# Altium project Starboard 2U.PrjPcb
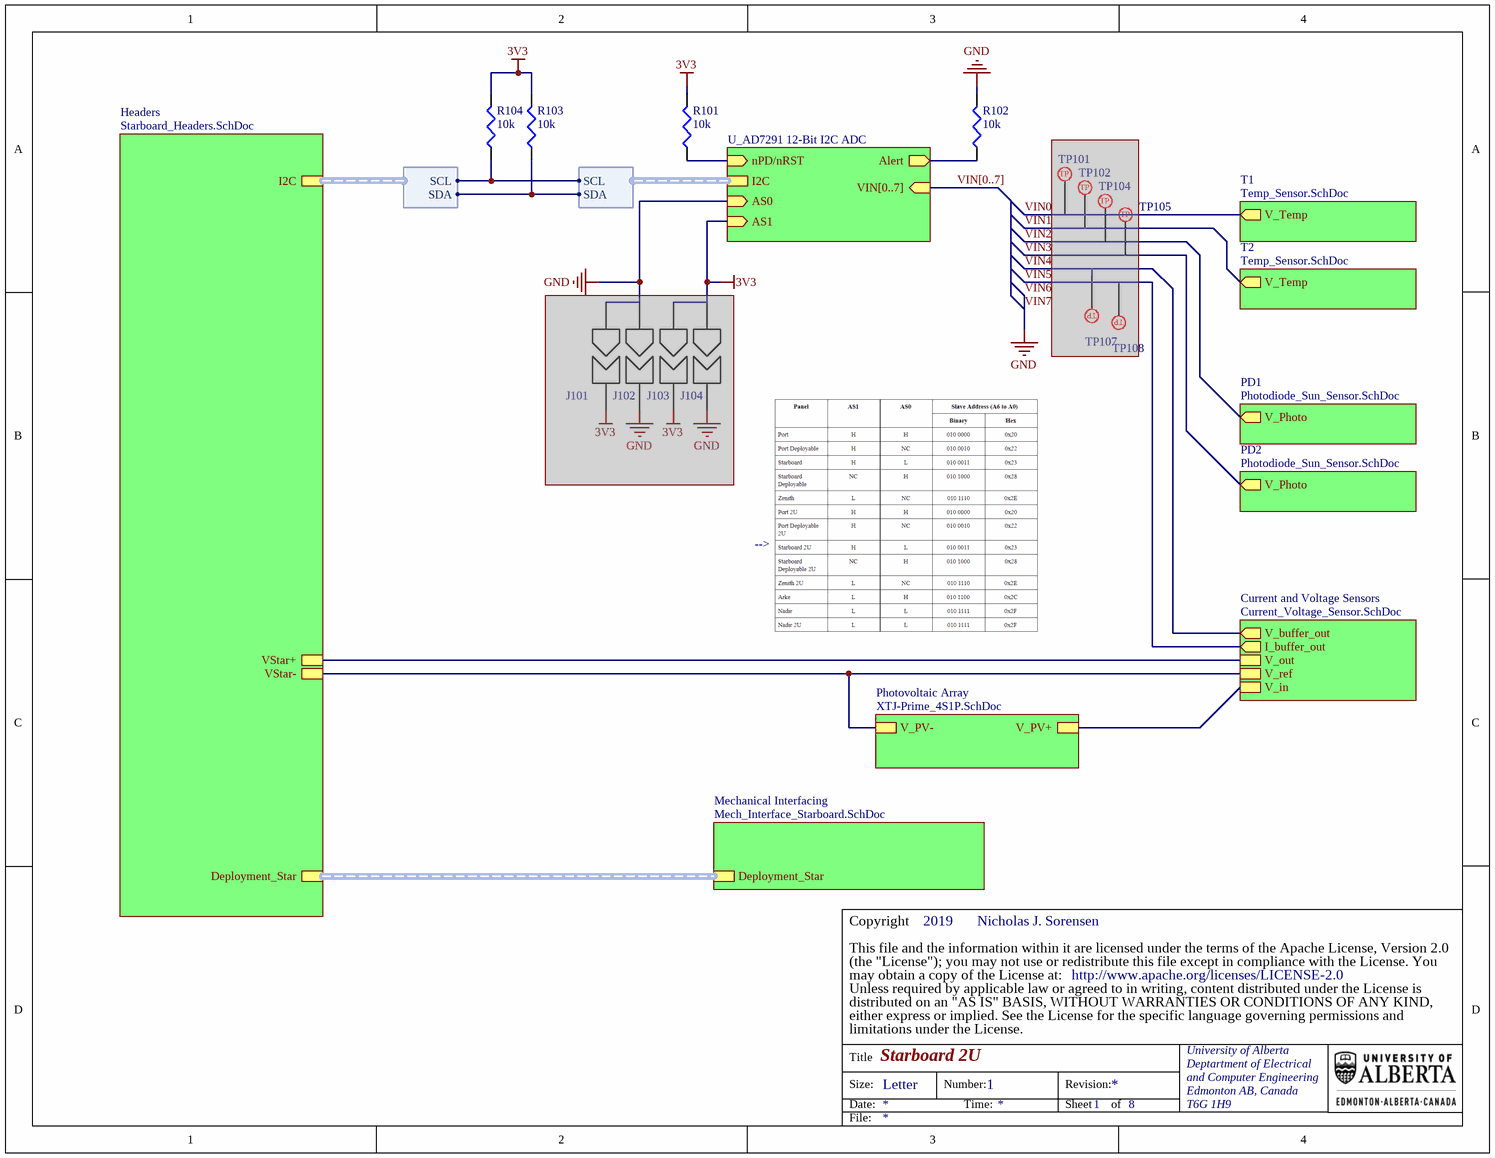
[diagram p0: Starboard 2U.SchDoc]
ProjectVersion: 4.03; SVNVersion: 3196
3 sheets, 33 parts. Net scope: hierarchical (ports join the sheet entries above them; power ports are global).
Board file: Starboard Solar Panel 2U.PcbDoc
Sheets:
  Starboard 2U.SchDoc
    Mechanical Interfacing = Mech_Interface_Starboard.SchDoc
    Headers = Starboard_Headers.SchDoc

## Sheet Starboard 2U.SchDoc: Starboard 2U
size Letter; Author: Nicholas J. Sorensen; DocumentNumber: 1; SheetNumber: 1; SheetTotal: 8; CopyrightYear: 2019

### Parts
J101  Jumping Pad  [Jumping Pad]  (value not drawn)  (masked out: inside a compile mask, not in the netlist)
J102  Jumping Pad  [Jumping Pad]  (value not drawn)  (masked out: inside a compile mask, not in the netlist)
J103  Jumping Pad  [Jumping Pad]  (value not drawn)  (masked out: inside a compile mask, not in the netlist)
J104  Jumping Pad  [Jumping Pad]  (value not drawn)  (masked out: inside a compile mask, not in the netlist)
R101  value 10k  [VSH-0603MCT]  (hidden comment: Res3)
R102  value 10k  [VSH-0603MCT]  (hidden comment: Res3)
R103  value 10k  [VSH-0603MCT]  (hidden comment: Res3)
R104  value 10k  [VSH-0603MCT]  (hidden comment: Res3)
TP101  5017  [KS-5017]  (value not drawn)  (masked out: inside a compile mask, not in the netlist)
TP102  5017  [KS-5017]  (value not drawn)  (masked out: inside a compile mask, not in the netlist)
TP104  5017  [KS-5017]  (value not drawn)  (masked out: inside a compile mask, not in the netlist)
TP105  5017  [KS-5017]  (value not drawn)  (masked out: inside a compile mask, not in the netlist)
TP107  5017  [KS-5017]  (value not drawn)  (masked out: inside a compile mask, not in the netlist)
TP108  5017  [KS-5017]  (value not drawn)  (masked out: inside a compile mask, not in the netlist)

### Sub-sheets
Current and Voltage Sensors = Current_Voltage_Sensor.SchDoc (file not in this document): V_out, V_ref, V_in, I_buffer_out (out), V_buffer_out (out)
Headers = Starboard_Headers.SchDoc: I2C (harness I2C), VStar+, Deployment_Star (harness Deployment_Star), VStar-
Mechanical Interfacing = Mech_Interface_Starboard.SchDoc: Deployment_Star (harness Deployment_Star)
PD1 = Photodiode_Sun_Sensor.SchDoc (file not in this document): V_Photo (out)
PD2 = Photodiode_Sun_Sensor.SchDoc (file not in this document): V_Photo (out)
Photovoltaic Array = XTJ-Prime_4S1P.SchDoc (file not in this document): V_PV+, V_PV-
T1 = Temp_Sensor.SchDoc (file not in this document): V_Temp (out)
T2 = Temp_Sensor.SchDoc (file not in this document): V_Temp (out)
U_AD7291 12-Bit I2C ADC = AD7291 12-Bit I2C ADC.SchDoc (file not in this document): nPD/nRST (in), Alert (out), VIN[0..7] (in), AS0 (in), AS1 (in), I2C (harness I2C)

### Harnesses
I2C: SCL, SDA

### Nets
3V3: R101.2 R103.2 R104.2 ; sheet U_AD7291 12-Bit I2C ADC/AS1
VIN6: R102.2 ; sheet U_AD7291 12-Bit I2C ADC/AS0  [also labelled GND, VIN7]
SCL: R104.1 ; sheet U_AD7291 12-Bit I2C ADC/I2C.SCL, sheet Headers/I2C.SCL
SDA: R103.1 ; sheet U_AD7291 12-Bit I2C ADC/I2C.SDA, sheet Headers/I2C.SDA
VIN0: sheet T1/V_Temp
VIN1: sheet T2/V_Temp
VIN2: sheet PD1/V_Photo
VIN3: sheet PD2/V_Photo
VIN4: sheet Current and Voltage Sensors/V_buffer_out
VIN5: sheet Current and Voltage Sensors/I_buffer_out
NetP805_1: sheet Photovoltaic Array/V_PV-, sheet Current and Voltage Sensors/V_ref, sheet Headers/VStar-
NetP805_3: sheet Current and Voltage Sensors/V_out, sheet Headers/VStar+
NetR101_1: R101.1 ; sheet U_AD7291 12-Bit I2C ADC/nPD/nRST
NetR102_1: R102.1 ; sheet U_AD7291 12-Bit I2C ADC/Alert
(unnamed): sheet Photovoltaic Array/V_PV+, sheet Current and Voltage Sensors/V_in

### Buses and harness runs
bus VIN[0..7] = sheet U_AD7291 12-Bit I2C ADC/VIN[0..7]
harness sheet Headers/Deployment_Star = sheet Mechanical Interfacing/Deployment_Star

### Notes on the sheet
- -->
- (the "License"); you may not use or redistribute this file except in compliance with the License. You
- This file and the information within it are licensed under the terms of the Apache License, Version 2.0
- Copyright
- Unless required by applicable law or agreed to in writing, content distributed under the License is
- distributed on an "AS IS" BASIS, WITHOUT WARRANTIES OR CONDITIONS OF ANY KIND,
- either express or implied. See the License for the specific language governing permissions and
- limitations under the License.
- may obtain a copy of the License at:
- http://www.apache.org/licenses/LICENSE-2.0
- Title
- Size:
- Date:
- Letter
- Number:
- Time:
- Revision:
- Sheet
- of
- University of Alberta
- Deptartment of Electrical
- and Computer Engineering
- Edmonton AB, Canada
- T6G 1H9
- File:
- (in symbol PTP-KS-00001) TP

### Library data of the parts
J101-J104 = PXX-ABS-00011: Manufacturer Part Number: Custom; Index: 11; Designator: J?; Part Number: PXX-ABS-00011; Supplier 1: Digi-key; Publisher: AlbertaSat; LatestRevisionNote: ...
R101-R104 = PR-VSH-00143: RES SMD 10K OHM 1% 1/8W 0603; Manufacturer Part Number: MCT06030C1002FP500; Index: 143; Designator: R?; Temperature Coefficient: ±50ppm/°C; Published: 3/14/2016; LatestRevisionDate: 3/14/2016; LatestRevisionNote: ...; PackageReference: 0603 (1608 Metric); Publisher: AlbertaSat; PackageDescription: Chip Resistor, 2-Leads, Body 1.55x0.85mm, IPC Low Density; Part Number: PR-VSH-00143; Supplier Part Number 1: MCT0603-10.0K-CFCT-ND; Supplier 1: Digi-key; Supplier Link: http://www.digikey.ca/product-search/en?keywords=MCT0603-10.0K-CFCT-ND; Tolerance: ±1%; Power - Rated: 1/8W; Applications: General Purpose
TP101 TP102 TP104 TP105 TP107 TP108 = PTP-KS-00001: PC TEST POINT MINI SMD; Index: 1; Supplier 1: Digi-key; Supplier 2: Newark; Supplier 3: Mouser; Part Number: PTP-KS-00001; Manufacturer Part Number: 5017; Supplier Part Number 1: 36-5017CT-ND; Publisher: AlbertaSat; Published: 3/15/2016; LatestRevisionDate: 3/15/2016; LatestRevisionNote: ...; PackageReference: KS-5017; PackageDescription: Testpoint Lug Mini SMD 27X10X152; Supplier Link: http://www.digikey.ca/product-detail/en/keystone-electronics/5017/36-5017TR-ND/2217304

## Sheet Mech_Interface_Starboard.SchDoc: Mech_Interface_Starboard
size Letter; Author: Nicholas J. Sorensen, and Erik F. Halliwell; Engineer: Nicholas J. Sorensen, and Erik F. Halliwell; DocumentNumber: 7; SheetNumber: 7; SheetTotal: 8
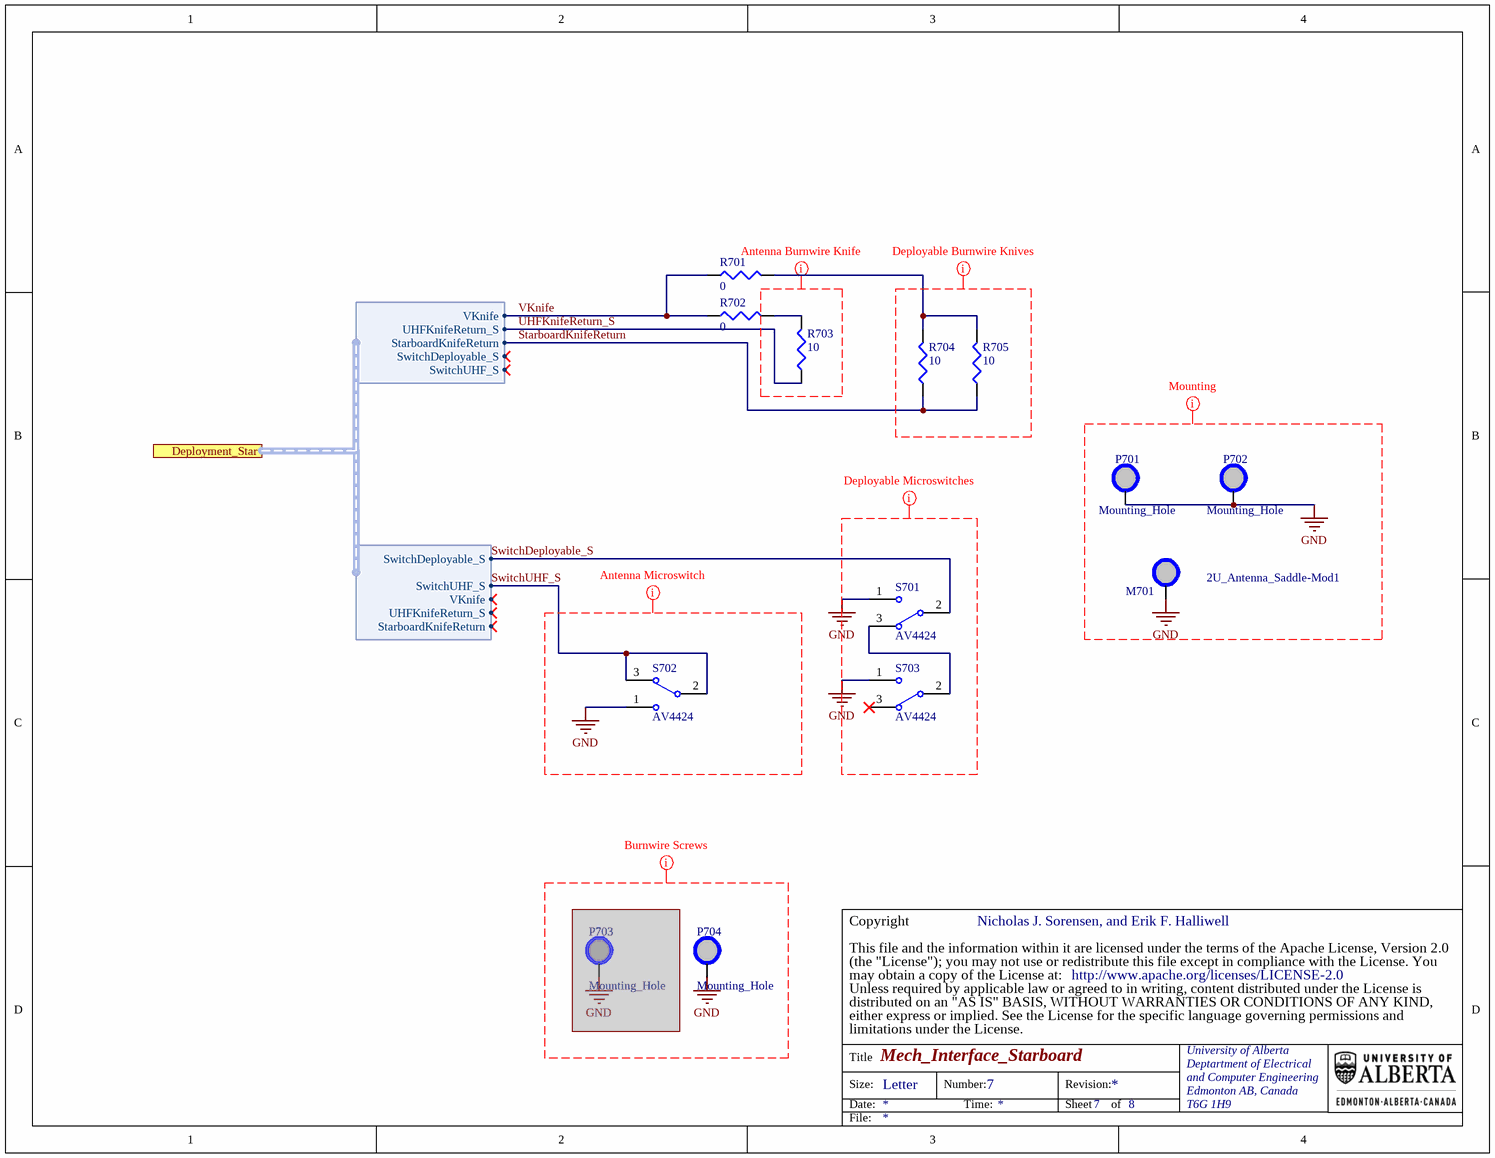
[diagram p1: Mech_Interface_Starboard.SchDoc]

### Parts
M701  2U_Antenna_Saddle-Mod1  [2U_Antenna_Saddle-Mod1]
P701  Mounting_Hole  [DEPHINGE_MOUNTING_HOLE_BODY]
P702  Mounting_Hole  [DEPHINGE_MOUNTING_HOLE_BODY]
P703  Mounting_Hole  [Burnwire_Screw]  (masked out: inside a compile mask, not in the netlist)
P704  Mounting_Hole  [Burnwire_Screw]
R701  value 0  [PANA-ERJ3G]  (hidden comment: Jumper)
R702  value 0  [PANA-ERJ3G]  (hidden comment: Jumper)
R703  value 10  [VSH-CPF1]  (hidden comment: Res3)
R704  value 10  [VSH-CPF1]  (hidden comment: Res3)
R705  value 10  [VSH-CPF1]  (hidden comment: Res3)
S701  AV4424  [PANA-AV4424]
S702  AV4424  [PANA-AV4424]
S703  AV4424  [PANA-AV4424]

### Ports
Deployment_Star (harness Deployment_Star)

### Harnesses
Deployment_Star: StarboardKnifeReturn, UHFKnifeReturn_S, VKnife, SwitchDeployable_S, SwitchUHF_S
Deployment_Star: SwitchDeployable_S, SwitchUHF_S, VKnife, StarboardKnifeReturn, UHFKnifeReturn_S

### Nets
GND: M701.1 P701.1 P702.1 P704.1 S701.1(NO) S702.1(NO) S703.1(NO)  [project net VIN6]
StarboardKnifeReturn: R704.1 R705.1 ; port Deployment_Star.StarboardKnifeReturn
SwitchDeployable_S: S701.2(COM) ; port Deployment_Star.SwitchDeployable_S
SwitchUHF_S: S702.2(COM) S702.3(NC) ; port Deployment_Star.SwitchUHF_S
UHFKnifeReturn_S: R703.1 ; port Deployment_Star.UHFKnifeReturn_S
VKnife: R701.1 R702.1 ; port Deployment_Star.VKnife
NetR701_2: R701.2 R704.2 R705.2
NetR702_2: R702.2 R703.2
NetS701_3: S701.3(NC) S703.2(COM)

Not connected (* = marked no-connect by the designer): S703 3(NC)*

### Layout directives
mark named Deployable Microswitches: GND
mark named Antenna Microswitch: GND
mark named Mounting: GND
mark named Deployable Burnwire Knives: (no net found under the mark)
mark named Antenna Burnwire Knife: (no net found under the mark)
mark named Burnwire Screws: GND

### Notes on the sheet
- (the "License"); you may not use or redistribute this file except in compliance with the License. You
- This file and the information within it are licensed under the terms of the Apache License, Version 2.0
- Copyright
- Unless required by applicable law or agreed to in writing, content distributed under the License is
- distributed on an "AS IS" BASIS, WITHOUT WARRANTIES OR CONDITIONS OF ANY KIND,
- either express or implied. See the License for the specific language governing permissions and
- limitations under the License.
- may obtain a copy of the License at:
- http://www.apache.org/licenses/LICENSE-2.0
- Title
- Size:
- Date:
- Letter
- Number:
- Time:
- Revision:
- Sheet
- of
- University of Alberta
- Deptartment of Electrical
- and Computer Engineering
- Edmonton AB, Canada
- T6G 1H9
- File:

### Library data of the parts
M701 = PXX-ABS-00019: Manufacturer Part Number: Custom; Index: 19; Designator: M?; Part Number: PXX-ABS-00019; Supplier 1: Digi-key; Publisher: AlbertaSat; LatestRevisionNote: ...
P701 P702 = PXX-ABS-00004: Manufacturer Part Number: Custom; Index: 4; Part Number: PXX-ABS-00004; Supplier 1: Digi-key; Publisher: AlbertaSat; LatestRevisionNote: ...
P703 P704 = PXX-ABS-00015: Manufacturer Part Number: Custom; Index: 15; Designator: M?; Part Number: PXX-ABS-00015; Supplier 1: Digi-key; Publisher: AlbertaSat; LatestRevisionNote: ...
R701 R702 = 13128: RES SMD 0.0OHM JUMPER 1/10W 0603; Part Number: 13128; Manufacturer Part Number: ERJ-3GEY0R00V; Designator: R?; Power: 0.1W, 1/10W; PackageDescription: Chip Resistor, 2-Leads, Body 1.60x0.80mm, IPC Low Density; Supplier Part Number 1: P0.0GCT-ND; Supplier 1: Digi-Key; Supplier Link: http://www.digikey.ca/product-search/en?keywords=P0.0GCT-ND; PackageReference: 0603 (1608 Metric); Tolerance: Jumper; Temperature Coefficient: -; Type: Jumper
R703-R705 = PR-VSH-00317: 21 Ohms ±1% 1W Through Hole Resistor Axial Flame Proof, Moisture Resistant, Safety Metal Film; Manufacturer Part Number: CPF121R000FKEE6; Index: 317; Designator: R?; Temperature Coefficient: ±100ppm/°C; Published: 2/27/2020; LatestRevisionDate: 2/27/2020; LatestRevisionNote: ...; PackageReference: VSH-CPF1; Publisher: AlbertaSat; PackageDescription: Chip Resistor; Part Number: PR-VSH-00317; Supplier Part Number 1: CPF21.0CCT-ND; Supplier 1: Digi-key; Supplier Link: #https://www.digikey.ca/product-detail/en/vishay-dale/CPF121R000FKEE6/CPF21.0CCT-ND/2713126#; Tolerance: ±1%; Power - Rated: 1W
S701-S703 = 20035: SWITCH SNAP ACT SPDT 500MA 30V; Part Number: 20035; Manufacturer Part Number: AV4424; Supplier Part Number 1: 255-3743-ND; Supplier 1: Digi-Key; Supplier Link: #https://www.digikey.com/product-detail/en/panasonic-electric-works/AV4424/255-3743-ND/646766#

## Sheet Starboard_Headers.SchDoc: Starboard_Headers
size Letter; Author: Nicholas J. Sorensen, and Erik F. Halliwell; Engineer: Nicholas J. Sorensen, and Erik F. HalliwellNicholas Sorensen, and Erik Halliwell; DocumentNumber: 8; SheetNumber: 8; SheetTotal: 8
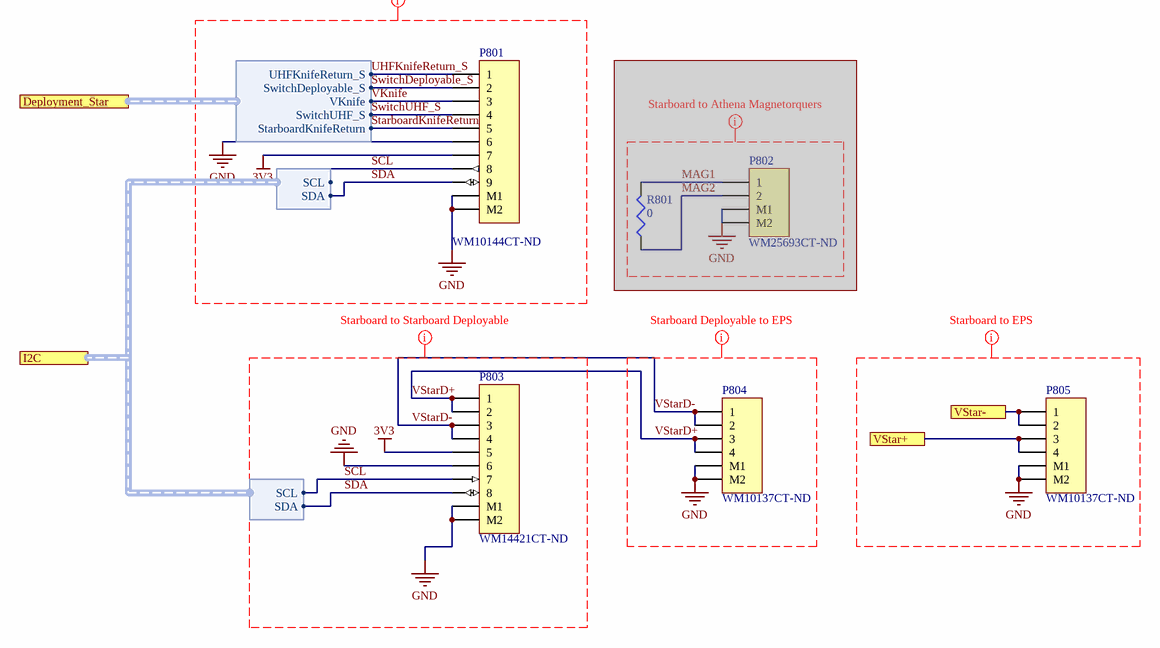
[diagram p2: Starboard_Headers.SchDoc]

### Parts
P801  WM10144CT-ND  [MOLX-5040500991]
P802  WM25693CT-ND  [MOLX-5040500291]  (masked out: inside a compile mask, not in the netlist)
P803  WM14421CT-ND  [MOLX-5040500891]
P804  WM10137CT-ND  [MOLX-5040500491]
P805  WM10137CT-ND  [MOLX-5040500491]
R801  value 0  [VSH-0805MCU]  (hidden comment: Res3)  (masked out: inside a compile mask, not in the netlist)

### Ports
Deployment_Star (harness Deployment_Star), I2C (harness I2C), VStar+, VStar-

### Harnesses
Deployment_Star: UHFKnifeReturn_S, SwitchDeployable_S, VKnife, StarboardKnifeReturn, SwitchUHF_S
I2C: SCL, SDA

### Nets
3V3: P801.7 P803.5
GND: P801.6 P801.M1 P801.M2 P803.6 P803.M1 P803.M2 P804.M1 P804.M2 P805.M1 P805.M2  [project net VIN6]
SCL: P801.8 P803.7 ; port I2C.SCL
SDA: P801.9 P803.8 ; port I2C.SDA
StarboardKnifeReturn: P801.5 ; port Deployment_Star.StarboardKnifeReturn
SwitchDeployable_S: P801.2 ; port Deployment_Star.SwitchDeployable_S
SwitchUHF_S: P801.4 ; port Deployment_Star.SwitchUHF_S
UHFKnifeReturn_S: P801.1 ; port Deployment_Star.UHFKnifeReturn_S
VKnife: P801.3 ; port Deployment_Star.VKnife
VStarD+: P803.1 P803.2 P804.3 P804.4
VStarD-: P803.3 P803.4 P804.1 P804.2
NetP805_1: P805.1 P805.2 ; port VStar-
NetP805_3: P805.3 P805.4 ; port VStar+

### Layout directives
mark named Starboard Deployable to EPS: GND, VStarD+, VStarD-
mark named Starboard to EPS: GND
mark named Starboard to Athena Magnetorquers: GND, MAG1, MAG2
mark named Starboard to Starboard Deployable: VStarD-
mark named Starboard to Athena Burnwires/I2C: 3V3, GND, SCL, SDA, StarboardKnifeReturn, SwitchDeployable_S, SwitchUHF_S, UHFKnifeReturn_S, VKnife

### Notes on the sheet
- (the "License"); you may not use or redistribute this file except in compliance with the License. You
- This file and the information within it are licensed under the terms of the Apache License, Version 2.0
- Copyright
- Unless required by applicable law or agreed to in writing, content distributed under the License is
- distributed on an "AS IS" BASIS, WITHOUT WARRANTIES OR CONDITIONS OF ANY KIND,
- either express or implied. See the License for the specific language governing permissions and
- limitations under the License.
- may obtain a copy of the License at:
- http://www.apache.org/licenses/LICENSE-2.0
- Title
- Size:
- Date:
- Letter
- Number:
- Time:
- Revision:
- Sheet
- of
- University of Alberta
- Deptartment of Electrical
- and Computer Engineering
- Edmonton AB, Canada
- T6G 1H9
- File:

### Library data of the parts
P801 = 68: CONN HEADER SMD R/A 9POS 1.5MM; Part Number: 68; Manufacturer Part Number: 5040500991; Designator: P?; LatestRevisionDate: 17-Jul-2002; LatestRevisionNote: Re-released for DXP Platform.; Publisher: Altium Limited; Supplier Part Number 1: WM25695CT-ND; Supplier 1: Digi-Key; Supplier Link: #https://www.digikey.ca/product-detail/en/molex/5040500991/WM25695CT-ND/9954121#
P802 = 61: CONN HEADER SMD R/A 2POS 1.5MM; Part Number: 61; Manufacturer Part Number: 5040500291; Designator: P?; LatestRevisionDate: 17-Jul-2002; LatestRevisionNote: Re-released for DXP Platform.; Publisher: Altium Limited; Supplier Part Number 1: WM25693CT-ND; Supplier 1: Digi-Key; Supplier Link: #https://www.digikey.ca/product-detail/en/molex/5040500291/WM25693CT-ND/9954119#
P803 = 67: CONN HEADER SMD R/A 8POS 1.5MM; Part Number: 67; Manufacturer Part Number: 5040500891; Designator: P?; LatestRevisionDate: 17-Jul-2002; LatestRevisionNote: Re-released for DXP Platform.; Publisher: Altium Limited; Supplier Part Number 1: WM14421CT-ND; Supplier 1: Digi-Key; Supplier Link: #https://www.digikey.ca/product-detail/en/molex/5040500891/WM14421CT-ND/6133151#
P804 P805 = 63: CONN HEADER SMD R/A 4POS 1.5MM; Part Number: 63; Manufacturer Part Number: 5040500491; Designator: P?; LatestRevisionDate: 17-Jul-2002; LatestRevisionNote: Re-released for DXP Platform.; Publisher: Altium Limited; Supplier Part Number 1: WM10137CT-ND; Supplier 1: Digi-Key; Supplier Link: #https://www.digikey.ca/product-detail/en/molex/5040500491/WM10137CT-ND/4357653#
R801 = PR-VSH-00003: RES SMD 0.0 OHM JUMPER 1/5W 0805; Manufacturer Part Number: MCU08050Z0000ZP500; Index: 3; Designator: R?; Published: 3/14/2016; LatestRevisionDate: 3/14/2016; LatestRevisionNote: ...; PackageReference: 0805 (2012 Metric); Publisher: AlbertaSat; PackageDescription: Chip Resistor, 2-Leads, Body 2.00x1.25mm, IPC Low Density; Part Number: PR-VSH-00003; Supplier Part Number 1: MCU0805-0.0-ZZCT-ND; Supplier 1: Digi-key; Supplier Link: http://www.digikey.ca/product-search/en?keywords=MCU0805-0.0-ZZCT-ND; Tolerance: Jumper; Power - Rated: 1/5W; Temperature Coefficient: -; Applications: General Purpose

## Nets that join several sheets
3V3: Starboard 2U (R101.2 R103.2 R104.2), Starboard_Headers (P801.7 P803.5)
VIN6: Starboard 2U (R102.2), Mech_Interface_Starboard (7 pins), Starboard_Headers (10 pins)
SCL: Starboard 2U (R104.1), Starboard_Headers (P801.8 P803.7)
SDA: Starboard 2U (R103.1), Starboard_Headers (P801.9 P803.8)
StarboardKnifeReturn: Mech_Interface_Starboard (R704.1 R705.1), Starboard_Headers (P801.5)
SwitchDeployable_S: Mech_Interface_Starboard (S701.2), Starboard_Headers (P801.2)
SwitchUHF_S: Mech_Interface_Starboard (S702.2 S702.3), Starboard_Headers (P801.4)
UHFKnifeReturn_S: Mech_Interface_Starboard (R703.1), Starboard_Headers (P801.1)
VKnife: Mech_Interface_Starboard (R701.1 R702.1), Starboard_Headers (P801.3)